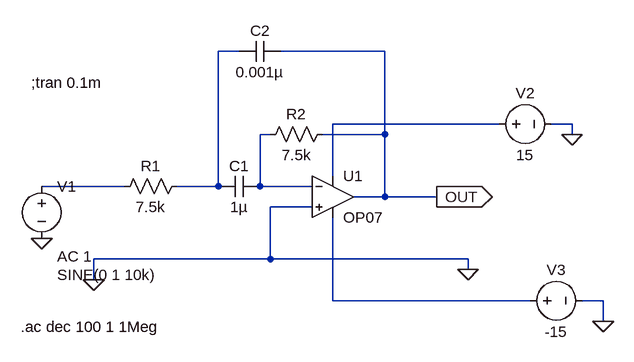
[diagram p0: schematic Filter1.asc]
Filter1.asc, the LTspice schematic file:
Version 4
SHEET 1 880 680
WIRE 0 -64 -32 -64
WIRE 224 -64 64 -64
WIRE 400 48 144 48
WIRE 512 48 480 48
WIRE 48 64 32 64
WIRE 224 64 224 -64
WIRE 224 64 128 64
WIRE 512 64 512 48
WIRE 144 128 144 48
WIRE -176 144 -304 144
WIRE -32 144 -32 -64
WIRE -32 144 -96 144
WIRE 32 144 32 64
WIRE 112 144 32 144
WIRE 224 160 224 64
WIRE 224 160 176 160
WIRE 304 160 224 160
WIRE 112 176 48 176
WIRE 48 256 48 176
WIRE 48 256 -224 256
WIRE 352 256 48 256
WIRE 352 272 352 256
WIRE -224 288 -224 256
WIRE 144 320 144 192
WIRE 448 320 144 320
WIRE 560 320 528 320
WIRE 560 352 560 320
FLAG -304 224 0
FLAG -224 288 0
FLAG 304 160 OUT
IOPIN 304 160 Out
FLAG 352 272 0
FLAG 512 64 0
FLAG 560 352 0
SYMBOL cap 32 128 R90
WINDOW 0 0 32 VBottom 2
WINDOW 3 32 32 VTop 2
SYMATTR InstName C1
SYMATTR Value 1µ
SYMBOL res -80 128 R90
WINDOW 0 0 56 VBottom 2
WINDOW 3 32 56 VTop 2
SYMATTR InstName R1
SYMATTR Value 7.5k
SYMBOL voltage -304 128 R0
WINDOW 3 24 152 Left 2
WINDOW 123 24 124 Left 2
WINDOW 39 0 0 Left 0
SYMATTR Value SINE(0 1 10k)
SYMATTR Value2 AC 1
SYMATTR InstName V1
SYMBOL voltage 384 48 R270
WINDOW 0 32 56 VTop 2
WINDOW 3 -32 56 VBottom 2
WINDOW 123 0 0 Left 0
WINDOW 39 0 0 Left 0
SYMATTR InstName V2
SYMATTR Value 15
SYMBOL OpAmps\\OP07 144 96 R0
SYMATTR InstName U1
SYMBOL res 144 48 R90
WINDOW 0 0 56 VBottom 2
WINDOW 3 32 56 VTop 2
SYMATTR InstName R2
SYMATTR Value 7.5k
SYMBOL cap 64 -80 R90
WINDOW 0 0 32 VBottom 2
WINDOW 3 32 32 VTop 2
SYMATTR InstName C2
SYMATTR Value 0.001µ
SYMBOL voltage 432 320 R270
WINDOW 0 32 56 VTop 2
WINDOW 3 -32 56 VBottom 2
WINDOW 123 0 0 Left 0
WINDOW 39 0 0 Left 0
SYMATTR InstName V3
SYMATTR Value -15
TEXT -336 360 Left 2 !.ac dec 100 1 1Meg
TEXT -320 -16 Left 2 !;tran 0.1m

The netlist it stands for:
* Filter1.asc
C1 N003 N001 1µ
R1 N001 N004 7.5k
V1 N004 0 SINE(0 1 10k) AC 1
V2 N002 0 15
XU1 0 N003 N002 N005 OUT LT1001  ; OP07, pins In+ In- V+ V- OUT
R2 OUT N003 7.5k
C2 OUT N001 0.001µ
V3 N005 0 -15
.ac dec 100 1 1Meg
;tran 0.1m
.lib LTC.lib
.backanno
.end